# Altium schematic sheet Sheet3.SchDoc
size A4
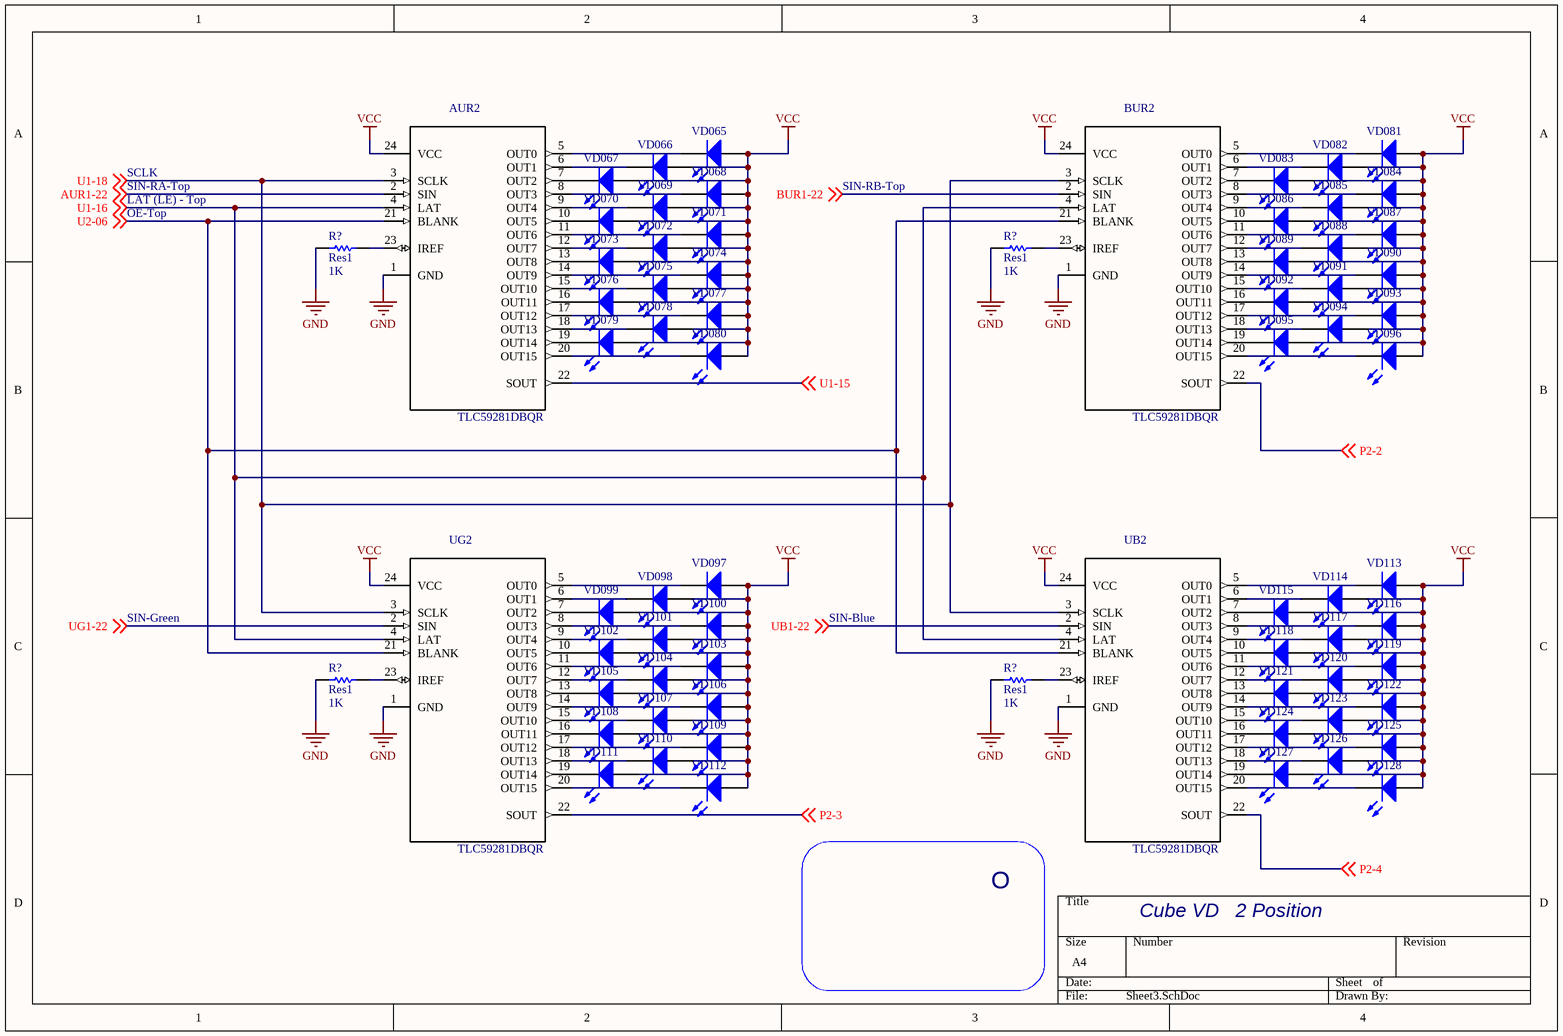
[diagram p0: Sheet3.SchDoc]

## Parts
(Parts that share a designator on the sheet are numbered #1, #2 ... from top to bottom, then left to right.)
AUR2  TLC59281DBQR  [SOP63P600X175-28N]
BUR2  TLC59281DBQR  [SOP63P600X175-28N]
R?#1  Res1  value 1K  [AXIAL-0.3]
R?#2  Res1  value 1K  [AXIAL-0.3]
R?#3  Res1  value 1K  [AXIAL-0.3]
R?#4  Res1  value 1K  [AXIAL-0.3]
UB2  TLC59281DBQR  [SOP63P600X175-28N]
UG2  TLC59281DBQR  [SOP63P600X175-28N]
VD065  LED  [LED-0]  (value not drawn)
VD066  LED  [LED-0]  (value not drawn)
VD067  LED  [LED-0]  (value not drawn)
VD068  LED  [LED-0]  (value not drawn)
VD069  LED  [LED-0]  (value not drawn)
VD070  LED  [LED-0]  (value not drawn)
VD071  LED  [LED-0]  (value not drawn)
VD072  (no value)  [LED-0]
VD073  LED  [LED-0]  (value not drawn)
VD074  (no value)  [LED-0]
VD075  LED  [LED-0]  (value not drawn)
VD076  LED  [LED-0]  (value not drawn)
VD077  LED  [LED-0]  (value not drawn)
VD078  LED  [LED-0]  (value not drawn)
VD079  LED  [LED-0]  (value not drawn)
VD080  LED  [LED-0]  (value not drawn)
VD081  LED  [LED-0]  (value not drawn)
VD082  LED  [LED-0]  (value not drawn)
VD083  LED  [LED-0]  (value not drawn)
VD084  LED  [LED-0]  (value not drawn)
VD085  LED  [LED-0]  (value not drawn)
VD086  LED  [LED-0]  (value not drawn)
VD087  LED  [LED-0]  (value not drawn)
VD088  LED  [LED-0]  (value not drawn)
VD089  LED  [LED-0]  (value not drawn)
VD090  LED  [LED-0]  (value not drawn)
VD091  LED  [LED-0]  (value not drawn)
VD092  LED  [LED-0]  (value not drawn)
VD093  LED  [LED-0]  (value not drawn)
VD094  LED  [LED-0]  (value not drawn)
VD095  LED  [LED-0]  (value not drawn)
VD096  LED  [LED-0]  (value not drawn)
VD097  LED  [LED-0]  (value not drawn)
VD098  LED  [LED-0]  (value not drawn)
VD099  LED  [LED-0]  (value not drawn)
VD100  LED  [LED-0]  (value not drawn)
VD101  LED  [LED-0]  (value not drawn)
VD102  LED  [LED-0]  (value not drawn)
VD103  LED  [LED-0]  (value not drawn)
VD104  LED  [LED-0]  (value not drawn)
VD105  LED  [LED-0]  (value not drawn)
VD106  LED  [LED-0]  (value not drawn)
VD107  LED  [LED-0]  (value not drawn)
VD108  LED  [LED-0]  (value not drawn)
VD109  LED  [LED-0]  (value not drawn)
VD110  LED  [LED-0]  (value not drawn)
VD111  LED  [LED-0]  (value not drawn)
VD112  LED  [LED-0]  (value not drawn)
VD113  LED  [LED-0]  (value not drawn)
VD114  LED  [LED-0]  (value not drawn)
VD115  LED  [LED-0]  (value not drawn)
VD116  LED  [LED-0]  (value not drawn)
VD117  LED  [LED-0]  (value not drawn)
VD118  LED  [LED-0]  (value not drawn)
VD119  LED  [LED-0]  (value not drawn)
VD120  LED  [LED-0]  (value not drawn)
VD121  LED  [LED-0]  (value not drawn)
VD122  LED  [LED-0]  (value not drawn)
VD123  LED  [LED-0]  (value not drawn)
VD124  LED  [LED-0]  (value not drawn)
VD125  LED  [LED-0]  (value not drawn)
VD126  LED  [LED-0]  (value not drawn)
VD127  LED  [LED-0]  (value not drawn)
VD128  LED  [LED-0]  (value not drawn)

## Nets
GND: AUR2.1(GND) BUR2.1(GND) R?#1.1 R?#2.1 R?#3.1 R?#4.1 UB2.1(GND) UG2.1(GND)
VCC: AUR2.24(VCC) BUR2.24(VCC) UB2.24(VCC) UG2.24(VCC) VD065.1(A) VD066.1(A) VD067.1(A) VD068.1(A) VD069.1(A) VD070.1(A) VD071.1(A) VD072.1(A) VD073.1(A) VD074.1(A) VD075.1(A) VD076.1(A) VD077.1(A) VD078.1(A) VD079.1(A) VD080.1(A) VD081.1(A) VD082.1(A) VD083.1(A) VD084.1(A) VD085.1(A) VD086.1(A) VD087.1(A) VD088.1(A) VD089.1(A) VD090.1(A) VD091.1(A) VD092.1(A) VD093.1(A) VD094.1(A) VD095.1(A) VD096.1(A) VD097.1(A) VD098.1(A) VD099.1(A) VD100.1(A) VD101.1(A) VD102.1(A) VD103.1(A) VD104.1(A) VD105.1(A) VD106.1(A) VD107.1(A) VD108.1(A) VD109.1(A) VD110.1(A) VD111.1(A) VD112.1(A) VD113.1(A) VD114.1(A) VD115.1(A) VD116.1(A) VD117.1(A) VD118.1(A) VD119.1(A) VD120.1(A) VD121.1(A) VD122.1(A) VD123.1(A) VD124.1(A) VD125.1(A) VD126.1(A) VD127.1(A) VD128.1(A)
AUR1-22: AUR2.2(SIN) ; off-sheet AUR1-22
BUR1-22: BUR2.2(SIN) ; off-sheet BUR1-22
P2-2: BUR2.22(SOUT) ; off-sheet P2-2
P2-3: UG2.22(SOUT) ; off-sheet P2-3
P2-4: UB2.22(SOUT) ; off-sheet P2-4
U1-15: AUR2.22(SOUT) ; off-sheet U1-15
U1-16: AUR2.4(LAT) BUR2.4(LAT) UB2.4(LAT) UG2.4(LAT) ; off-sheet U1-16
U1-18: AUR2.3(SCLK) BUR2.3(SCLK) UB2.3(SCLK) UG2.3(SCLK) ; off-sheet U1-18
U2-06: AUR2.21(BLANK) BUR2.21(BLANK) UB2.21(BLANK) UG2.21(BLANK) ; off-sheet U2-06
UB1-22: UB2.2(SIN) ; off-sheet UB1-22
UG1-22: UG2.2(SIN) ; off-sheet UG1-22
NetAUR2_5: AUR2.5(OUT0) VD065.2(K)
NetAUR2_6: AUR2.6(OUT1) VD066.2(K)
NetAUR2_7: AUR2.7(OUT2) VD067.2(K)
NetAUR2_8: AUR2.8(OUT3) VD068.2(K)
NetAUR2_9: AUR2.9(OUT4) VD069.2(K)
NetAUR2_10: AUR2.10(OUT5) VD070.2(K)
NetAUR2_11: AUR2.11(OUT6) VD071.2(K)
NetAUR2_12: AUR2.12(OUT7) VD072.2(K)
NetAUR2_13: AUR2.13(OUT8) VD073.2(K)
NetAUR2_14: AUR2.14(OUT9) VD074.2(K)
NetAUR2_15: AUR2.15(OUT10) VD075.2(K)
NetAUR2_16: AUR2.16(OUT11) VD076.2(K)
NetAUR2_17: AUR2.17(OUT12) VD077.2(K)
NetAUR2_18: AUR2.18(OUT13) VD078.2(K)
NetAUR2_19: AUR2.19(OUT14) VD079.2(K)
NetAUR2_20: AUR2.20(OUT15) VD080.2(K)
NetAUR2_23: AUR2.23(IREF) R?#1.2
NetBUR2_5: BUR2.5(OUT0) VD081.2(K)
NetBUR2_6: BUR2.6(OUT1) VD082.2(K)
NetBUR2_7: BUR2.7(OUT2) VD083.2(K)
NetBUR2_8: BUR2.8(OUT3) VD084.2(K)
NetBUR2_9: BUR2.9(OUT4) VD085.2(K)
NetBUR2_10: BUR2.10(OUT5) VD086.2(K)
NetBUR2_11: BUR2.11(OUT6) VD087.2(K)
NetBUR2_12: BUR2.12(OUT7) VD088.2(K)
NetBUR2_13: BUR2.13(OUT8) VD089.2(K)
NetBUR2_14: BUR2.14(OUT9) VD090.2(K)
NetBUR2_15: BUR2.15(OUT10) VD091.2(K)
NetBUR2_16: BUR2.16(OUT11) VD092.2(K)
NetBUR2_17: BUR2.17(OUT12) VD093.2(K)
NetBUR2_18: BUR2.18(OUT13) VD094.2(K)
NetBUR2_19: BUR2.19(OUT14) VD095.2(K)
NetBUR2_20: BUR2.20(OUT15) VD096.2(K)
NetBUR2_23: BUR2.23(IREF) R?#2.2
NetR?#3_2: R?#3.2 UG2.23(IREF)
NetR?#4_2: R?#4.2 UB2.23(IREF)
NetUB2_5: UB2.5(OUT0) VD113.2(K)
NetUB2_6: UB2.6(OUT1) VD114.2(K)
NetUB2_7: UB2.7(OUT2) VD115.2(K)
NetUB2_8: UB2.8(OUT3) VD116.2(K)
NetUB2_9: UB2.9(OUT4) VD117.2(K)
NetUB2_10: UB2.10(OUT5) VD118.2(K)
NetUB2_11: UB2.11(OUT6) VD119.2(K)
NetUB2_12: UB2.12(OUT7) VD120.2(K)
NetUB2_13: UB2.13(OUT8) VD121.2(K)
NetUB2_14: UB2.14(OUT9) VD122.2(K)
NetUB2_15: UB2.15(OUT10) VD123.2(K)
NetUB2_16: UB2.16(OUT11) VD124.2(K)
NetUB2_17: UB2.17(OUT12) VD125.2(K)
NetUB2_18: UB2.18(OUT13) VD126.2(K)
NetUB2_19: UB2.19(OUT14) VD127.2(K)
NetUB2_20: UB2.20(OUT15) VD128.2(K)
NetUG2_5: UG2.5(OUT0) VD097.2(K)
NetUG2_6: UG2.6(OUT1) VD098.2(K)
NetUG2_7: UG2.7(OUT2) VD099.2(K)
NetUG2_8: UG2.8(OUT3) VD100.2(K)
NetUG2_9: UG2.9(OUT4) VD101.2(K)
NetUG2_10: UG2.10(OUT5) VD102.2(K)
NetUG2_11: UG2.11(OUT6) VD103.2(K)
NetUG2_12: UG2.12(OUT7) VD104.2(K)
NetUG2_13: UG2.13(OUT8) VD105.2(K)
NetUG2_14: UG2.14(OUT9) VD106.2(K)
NetUG2_15: UG2.15(OUT10) VD107.2(K)
NetUG2_16: UG2.16(OUT11) VD108.2(K)
NetUG2_17: UG2.17(OUT12) VD109.2(K)
NetUG2_18: UG2.18(OUT13) VD110.2(K)
NetUG2_19: UG2.19(OUT14) VD111.2(K)
NetUG2_20: UG2.20(OUT15) VD112.2(K)

## Notes on the sheet
- SCLK
- OE-Top
- SIN-RA-Top
- LAT (LE) - Top
- SIN-RB-Top
- SIN-Green
- SIN-Blue
- O
- Cube VD   2 Position

## Library data of the parts
AUR2 BUR2 UB2 UG2 = TLC59281DBQR: 16-Channel, Constant-Current LED Driver without LED Open Detection 24-SSOP -40 to 85; MF: Texas Instruments; Price: 0.74 USD; Availability: Good; SnapEDA_Link: https://www.snapeda.com/parts/TLC59281DBQR/Texas%20Instruments/view-part/?ref=snap; MP: TLC59281DBQR; Package: SSOP-24 Texas Instruments; Value: *
R?#1-R?#4 = Res1: Resistor; Published: 8-Jun-2000; LatestRevisionDate: 17-Jul-2002; LatestRevisionNote: Re-released for DXP Platform.; PackageReference: AXIAL-0.3; Publisher: Altium Limited; PackageDescription: Axial Device, Thru-Hole; 2 Leads; 0.3 in Pin Spacing
VD065 VD066 VD067 VD068 VD069 VD070 VD071 VD072 VD073 VD074 VD075 VD076 VD077 VD078 VD079 VD080 VD081 VD082 VD083 VD084 VD085 VD086 VD087 VD088 VD089 VD090 VD091 VD092 VD093 VD094 VD095 VD096 VD097 VD098 VD099-VD128 = LED0: Typical INFRARED GaAs LED; Published: 8-Jun-2000; LatestRevisionDate: 08-Jul-2005; LatestRevisionNote: Mech Layer 1 removed.; PackageReference: LED-0; Publisher: Altium Limited; PackageDescription: LED; 2 Leads